# Altium schematic sheet SC10033E1.SchDoc: TOP
size A3; PCB PN: PB10013; PCBA PN: PA00013
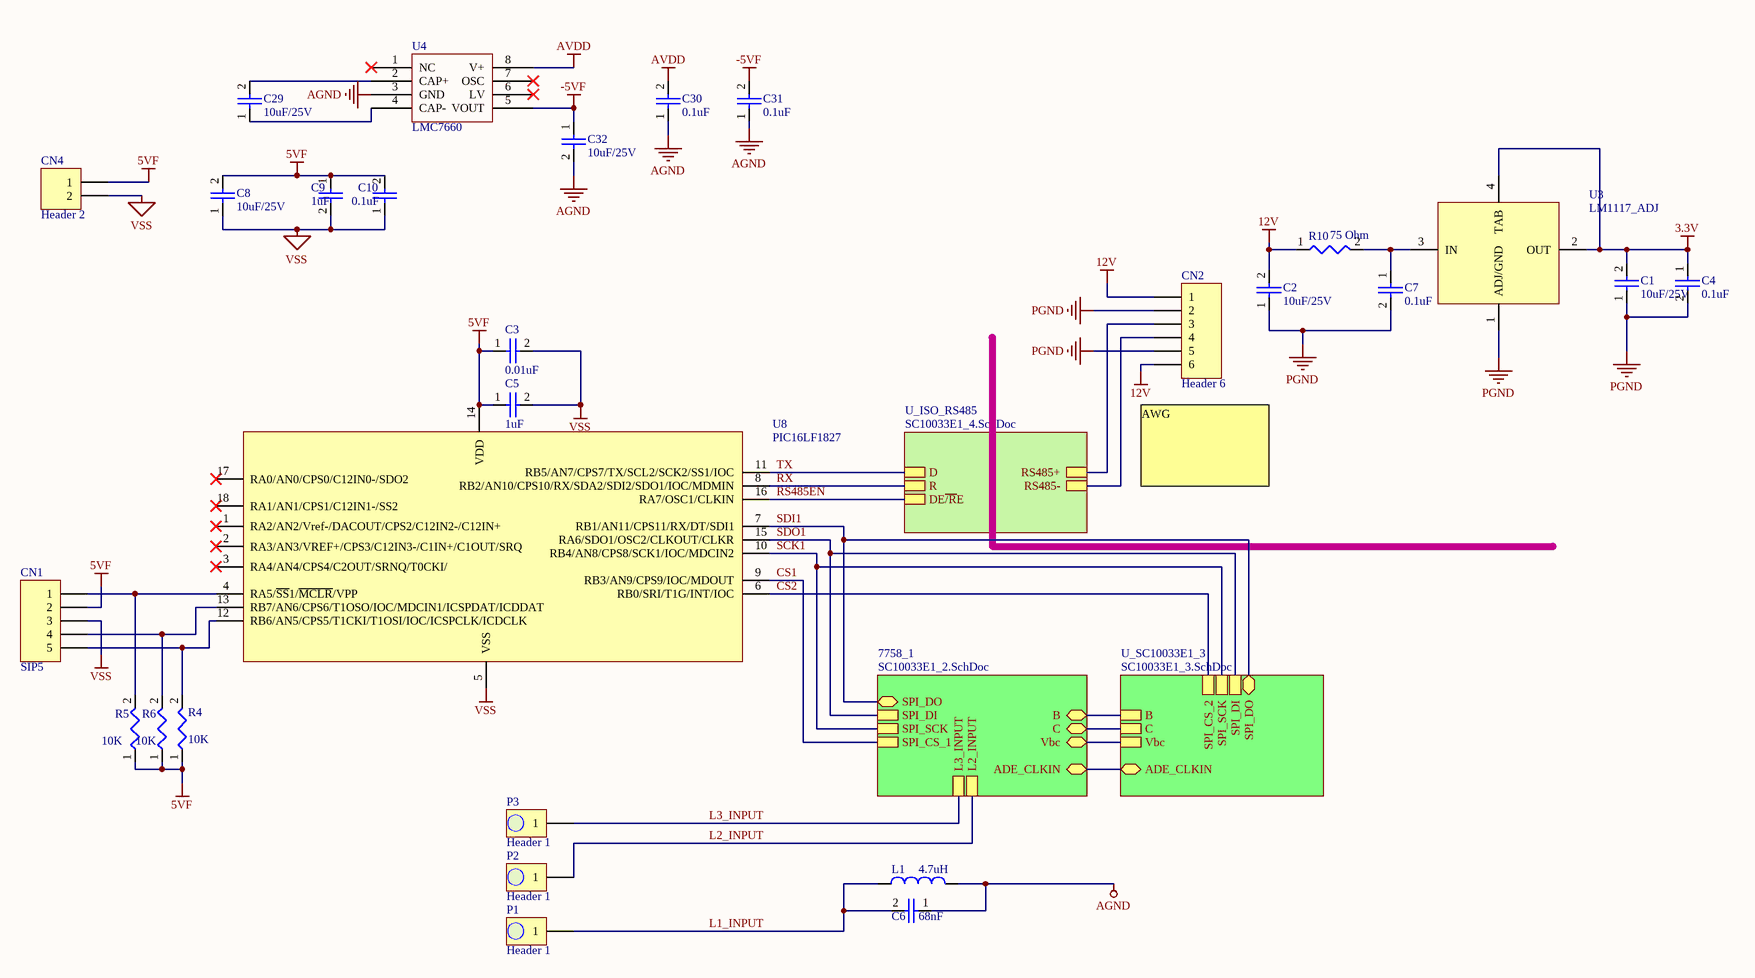
[diagram p0: SC10033E1.SchDoc]

## Parts
C1  value 10uF/25V  [C1206]  (hidden comment: CAP)
C2  value 10uF/25V  [C1206]  (hidden comment: CAP)
C3  value 0.01uF  [C0805]  (hidden comment: CAP)
C4  value 0.1uF  [C0805]  (hidden comment: CAP)
C5  value 1uF  [C0805]  (hidden comment: CAP)
C6  value 68nF  [C1206]  (hidden comment: CAP)
C7  value 0.1uF  [C0805]  (hidden comment: CAP)
C8  value 10uF/25V  [C1206]  (hidden comment: CAP)
C9  value 1uF  [C0805]  (hidden comment: CAP)
C10  value 0.1uF  [C0805]  (hidden comment: CAP)
C29  value 10uF/25V  [C1206]  (hidden comment: CAP)
C30  value 0.1uF  [C0805]  (hidden comment: CAP)
C31  value 0.1uF  [C0805]  (hidden comment: CAP)
C32  value 10uF/25V  [C1206]  (hidden comment: CAP)
CN1  SIP5  [SIP5]  (no BOM)
CN2  Header 6  [532590529-6P]
CN4  Header 2  [70551-2P]
L1  value 4.7uH  [L1008]  (hidden comment: Inductor)
P1  Header 1  (no BOM)
P2  Header 1  (no BOM)
P3  Header 1  (no BOM)
R4  value 10K  [R0603]  (hidden comment: RES)
R5  value 10K  [R0603]  (hidden comment: RES)
R6  value 10K  [R0603]  (hidden comment: RES)
R10  value 75 Ohm  [R2512]  (hidden comment: RES)
U3  LM1117_ADJ  [DPAK-134]
U4  LMC7660  [SOIC8]
U8  PIC16LF1827  [SO18]

## Sub-sheets
7758_1 = SC10033E1_2.SchDoc: L2_INPUT, L3_INPUT, SPI_DI, SPI_DO (bidir), SPI_SCK, SPI_CS_1, B, C, Vbc, ADE_CLKIN (bidir)
U_ISO_RS485 = SC10033E1_4.SchDoc: R, D, DE~{/R}E, RS485+, RS485-
U_SC10033E1_3 = SC10033E1_3.SchDoc: B, C, SPI_DI, SPI_DO (bidir), SPI_SCK, SPI_CS_2, ADE_CLKIN (bidir), Vbc

## Nets
3.3V: C1.2 C4.1 U3.2(OUT) U3.4(TAB)
5VF: C3.1 C5.1 C8.2 C9.1 C10.2 CN1.2 CN4.1 R4.1 R5.1 R6.1 U8.14(VDD)
12V: C2.2 CN2.1 CN2.6 R10.1
-5VF: C31.2 C32.1 U4.5(VOUT)
AGND: C6.1 C30.1 C31.1 C32.2 L1.2 U4.3(GND)
AVDD: C30.2 U4.8(V+)
PGND: C1.1 C2.1 C4.2 C7.2 CN2.2 CN2.5 U3.1(ADJ/GND)
VSS: C3.2 C5.2 C8.1 C9.2 C10.1 CN1.3 CN4.2 U8.5(VSS)
CS1: U8.9(RB3/AN9/CPS9/IOC/MDOUT) ; sheet 7758_1/SPI_CS_1
CS2: U8.6(RB0/SRI/T1G/INT/IOC) ; sheet U_SC10033E1_3/SPI_CS_2
L1_INPUT: C6.2 L1.1 P1.1
L2_INPUT: P2.1 ; sheet 7758_1/L2_INPUT
L3_INPUT: P3.1 ; sheet 7758_1/L3_INPUT
RS485EN: U8.16(RA7/OSC1/CLKIN) ; sheet U_ISO_RS485/DE~{/R}E
RX: U8.8(RB2/AN10/CPS10/RX/SDA2/SDI2/SDO1/IOC/MDMIN) ; sheet U_ISO_RS485/R
SCK1: U8.10(RB4/AN8/CPS8/SCK1/IOC/MDCIN2) ; sheet 7758_1/SPI_SCK, sheet U_SC10033E1_3/SPI_SCK
SDI1: U8.7(RB1/AN11/CPS11/RX/DT/SDI1) ; sheet 7758_1/SPI_DO, sheet U_SC10033E1_3/SPI_DO
SDO1: U8.15(RA6/SDO1/OSC2/CLKOUT/CLKR) ; sheet 7758_1/SPI_DI, sheet U_SC10033E1_3/SPI_DI
TX: U8.11(RB5/AN7/CPS7/TX/SCL2/SCK2/SS1/IOC) ; sheet U_ISO_RS485/D
NetC7_1: C7.1 R10.2 U3.3(IN)
NetC29_1: C29.1 U4.4(CAP-)
NetC29_2: C29.2 U4.2(CAP+)
NetCN1_1: CN1.1 R5.2 U8.4(RA5/~{SS}1/~{MCLR}/VPP)
NetCN1_4: CN1.4 R6.2 U8.13(RB7/AN6/CPS6/T1OSO/IOC/MDCIN1/ICSPDAT/ICDDAT)
NetCN1_5: CN1.5 R4.2 U8.12(RB6/AN5/CPS5/T1CKI/T1OSI/IOC/ICSPCLK/ICDCLK)
NetCN2_3: CN2.3 ; sheet U_ISO_RS485/RS485+
NetCN2_4: CN2.4 ; sheet U_ISO_RS485/RS485-
(unnamed): sheet 7758_1/B, sheet U_SC10033E1_3/B
(unnamed): sheet 7758_1/C, sheet U_SC10033E1_3/C
(unnamed): sheet 7758_1/Vbc, sheet U_SC10033E1_3/Vbc
(unnamed): sheet 7758_1/ADE_CLKIN, sheet U_SC10033E1_3/ADE_CLKIN

Not connected (* = marked no-connect by the designer): U4 1(NC)* 6(LV)* 7(OSC)*; U8 1(RA2/AN2/Vref-/DACOUT/CPS2/C12IN2-/C12IN+)* 2(RA3/AN3/VREF+/CPS3/C12IN3-/C1IN+/C1OUT/SRQ)* 3(RA4/AN4/CPS4/C2OUT/SRNQ/T0CKI/)* 17(RA0/AN0/CPS0/C12IN0-/SDO2)* 18(RA1/AN1/CPS1/C12IN1-/SS2)*

## Notes on the sheet
- (near CN2) AWG

## Library data of the parts
C1 C2 C8 C29 C32 = EC00088: CAP,CMCC,10uF,25V,10%,X7R,1206,SMD,ROHS; Manufacturer: Murata; Manufacturer P/N: GRM31CR71E106KA12L; ID: 88; Type: ****; HelpURL: \\192.168.1.3\Esh\Department\RD\CAD\Component\Capacitor\smd\Murata_GRM31CR71E106KA12L.pdf; P/N: EC00088
C3 = EC00018: CAP SMD CR X7R 50V 10% 10nF 0805 ROHS; Manufacturer: Murata; Manufacturer P/N: GRM216R71H103KA01D; ID: 18; HelpURL: *; P/N: EC00018
C4 C7 C10 = EC00078: CAP SMD CR X7R 50V 10% 0.1uF 0805 ROHS; Manufacturer: Murata; Manufacturer P/N: GRM21BR71H104KA01; ID: 78; Type: ****; HelpURL: \\192.168.1.3\Esh\Department\RD\CAD\Component\Capacitor\smd\Murata_GRM21BR71H104KA01#.pdf; P/N: EC00078
C5 = EC00002: CAP SMD CR X7R 50V 10% 1uF 0805 ROHS; Manufacturer: YAGEO; Manufacturer P/N: CC0805KKX7R9BB105; ID: 2; HelpURL: *; P/N: EC00002
C6 = EC00059: CAP SMD C0G 50V 5% 68nF 1206 ROHS; Manufacturer: Murata; Manufacturer P/N: GRM31C5C1H683JA01L; ID: 59; HelpURL: *; P/N: EC00059
C9 = EC00055: CAP SMD CR X7R 50V 10% 1uF 0805 ROHS; Manufacturer: Murata; Manufacturer P/N: GRM21BR71H105KA12L; ID: 55; HelpURL: *; P/N: EC00055
C30 C31 = EC00014: CAP SMD CR X7R 50V 10% 0.1uF 0805 ROHS; Manufacturer: YAGEO; Manufacturer P/N: CC0805KRX7R9BB104; ID: 14; HelpURL: *; P/N: EC00014
CN1 = EJ00017: CONNECTOR 5PIN,2.54PITCH,SIP-5; Manufacturer: 信荣; Manufacturer P/N: PH2.54*1*5*11.6/3.0; ID: 17; P/N: EJ00017; Value: SIP-5
CN2 = EJ00053: CONNECTOR 6PIN,3.5PITCH,PTH,ROHS; Manufacturer P/N: 532590629; Manufacturer: MOLEX; ID: 53; Value: 532590629; HelpURL: \\192.168.1.3\Esh\Department\RD\CAD\Component\connector\molex\532590529_sd.pdf; P/N: EJ00053; Type: *****
CN4 = EJ00051: CONNECTOR 2PIN,2.54PITCH,90 Degrees,PTH; Manufacturer P/N: 705510001; Manufacturer: MOLEX; ID: 51; Value: 705510001; HelpURL: \\192.168.1.3\Esh\Department\RD\CAD\Component\connector\molex\705510004.pdf; P/N: EJ00051
L1 = EL00009: INDUCTOR 4.7uH 0.45A 5%,SRF = 50MHz,Q = 26, SMD 1008 ROHS; Manufacturer: Wuerth Electronic; Manufacturer P/N: 74479887247; ID: 9; Type: ****; HelpURL: \\192.168.1.3\Esh\Department\RD\CAD\Component\Inductor\WE_74479887247.pdf; P/N: EL00009
P1-P3 = Header 1: Header, 1-Pin
R4-R6 = ER00213: RES THICK_FILM SMD 10K ohm 5% 1/10W ROHS 0603; Manufacturer: YAGEO; Manufacturer P/N: RC0603JR-1310KL; ID: 213; HelpURL: \\192.168.1.3\Esh\Department\RD\CAD\Component\Resistor\SMD\YAGEO_PYu-RC1206_51_RoHS_L_4.pdf; P/N: ER00213
R10 = ER00212: RES THICK_FILM SMD 75 ohm 5% 1W ROHS 2512; Manufacturer: YAGEO; Manufacturer P/N: RC2512JK-0775RL; ID: 212; HelpURL: \\192.168.1.3\Esh\Department\RD\CAD\Component\Resistor\SMD\YAGEO_PYu-RC1206_51_RoHS_L_4.pdf; P/N: ER00212
U3 = EU00066: IC REG VOLT +3.3V LDO 800MA DPAK ROHS; Manufacturer P/N: LD1117DT33TR; Manufacturer: ST; ID: 66; Value: LD1117-3.3; HelpURL: \\192.168.1.3\Esh\Department\RD\CAD\Component\Power_DC_to_DC\LD1117_ST.pdf; P/N: EU00066; Type: *****
U4 = EU00046: IC CMOS Voltage Converters; Manufacturer P/N: LMC7660IM; Manufacturer: National Semiconductor; ID: 46; Value: LMC7660IM; HelpURL: \\192.168.1.3\Esh\Department\RD\CAD\Component\Power_DC_to_DC\LMC7660.pdf; P/N: EU00046; Type: *****
U8 = EU00033: IC 8-bit UART SPI I2C,SOIC18-W,SMD,ROHS; Manufacturer P/N: PIC16F1827-I/SO; Manufacturer: Microchip; ID: 33; Value: PIC16F1827-I/SO; HelpURL: \\192.168.1.3\Esh\Department\RD\CAD\Component\MCU\PIC16F1827.pdf; P/N: EU00033; Type: *****